# EAGLE design RemoteMotion (EAGLE 9.0.0)
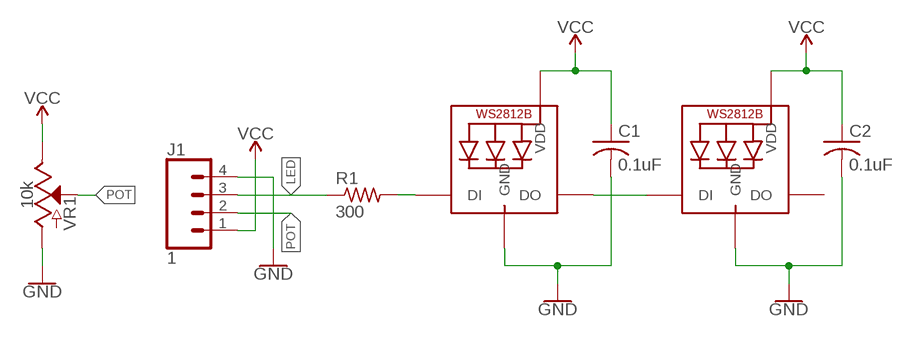
[diagram p0: schematic, sheet 1]

## Parts
C1  0.1uF  C-USC0805  [C0805]
C2  0.1uF  C-USC0805  [C0805]
J1  1  CONN_04JST-PTH  [JST-4-PTH]
LED1  WS2812B5050  [WS2812B]
LED2  WS2812B5050  [WS2812B]
R1  300  R-US_R0805  [R0805]
VR1  10k  POTENTIOMETER_SLIDE-60MM-1/2W-20%  [SLIDER-XLARGE]

## Nets
GND [VCC]: C1.2 C2.2 J1.4 LED1.3-GND(GND) LED2.3-GND(GND) VR1.3(A)
LED: J1.3 R1.1
N$1: LED1.4-DIN(DI) R1.2
N$2: LED1.2-DOUT(DO) LED2.4-DIN(DI)
POT: J1.2 VR1.2A(S)
VCC: C1.1 C2.1 J1.1 LED1.1-VDD(VDD) LED2.1-VDD(VDD) VR1.1(E)
Unconnected: LED2.2-DOUT(DO)

## Library data of the parts
C1 C2 = RemoteMotion:C-US: CAPACITOR, American symbol; SPICEPREFIX: C
J1 = RemoteMotion:CONN_04: Multi connection point. Often used as Generic Header-pin footprint for 0.1 inch spaced/style header connections On any of the 0.1 inch spaced packages, you can populate with these: Break Away Headers - Straight <https://www.sparkfun.com/products/116> (PRT-00116) Break Away Male Headers - Right Angle <https://www.sparkfun.com/products/553> (PRT-00553) Female Headers <https://www.sparkfun.com/products/115> (PRT-00115) Break Away Headers - Machine Pin <https://www.sparkfun.com/products/117> (PRT-00117) Break Away Female Headers - Swiss Machine Pin <https://www.sparkfun.com/products/743> (PRT-00743) For SCREWTERMINALS and SPRING TERMINALS visit here: Screw Terimnals on SparkFun.com <https://www.sparkfun.com/search/results?term=Screw+Terminals> (5mm/3.5mm/2.54mm spacing) This device is also useful as a general connection point to wire up your design to another part of your project. Our various solder wires solder well into these plated through hole pads. Hook-Up Wire - Assortment (Stranded, 22 AWG) <https://www.sparkfun.com/products/11375> (PRT-11375) Hook-Up Wire - Assortment (Solid Core, 22 AWG) <https://www.sparkfun.com/products/11367> (PRT-11367) View the entire wire category on our website here <https://www.sparkfun.com/categories/141> Special notes: Molex polarized connector foot print use with SKU : PRT-08231 with associated crimp pins and housings. 1MM SMD Version SKU: PRT-10208; PROD_ID: WIRE-13531; SF_ID: PRT-09916
LED1 LED2 = RemoteMotion:WS2812B
R1 = RemoteMotion:R-US_: RESISTOR, American symbol; SPICEPREFIX: R
VR1 = RemoteMotion:POTENTIOMETER_SLIDE: Slide Potentiometer Slide-type potentiometers - pots that are adjusted by sliding a wiper up or down. Commonly found en-masse on sound boards. Variants 60MM - Slide Pot - X-Large (10k Linear Taper) <https://www.sparkfun.com/products/9119> (COM-09119) 10k linear slide pot with 60mm travel. Datasheet <http://cdn.sparkfun.com/datasheets/Components/Switches/SC608N-b10k.pdf> 30MM, 30MM-KIT - Slide Pot - Medium (10k Linear Taper) <https://www.sparkfun.com/products/11621> (COM-11621) 10k linear slide pot with 30mm travel. Datasheet <http://cdn.sparkfun.com/datasheets/Components/Switches/C-31-.pdf> (C3031N-1A2-B10K-GP) "KIT" variant, intended for soldering kits, has tStop removed from pads so the component can only be stuffed on one side of the board. 20MM - Slide Pot - Small (10k Linear Taper) <https://www.sparkfun.com/products/11620> (COM-11620) 10k linear slide pot with 20mm travel. Datasheet <http://cdn.sparkfun.com/datasheets/Components/Switches/C-31-.pdf> (C2031N-1A2-B10K-GP); PROD_ID: RES-09484; SF_SKU: COM-09119

## Net classes
0 default: width 0.203 mm
1 VCC: width 0.254 mm

## Board
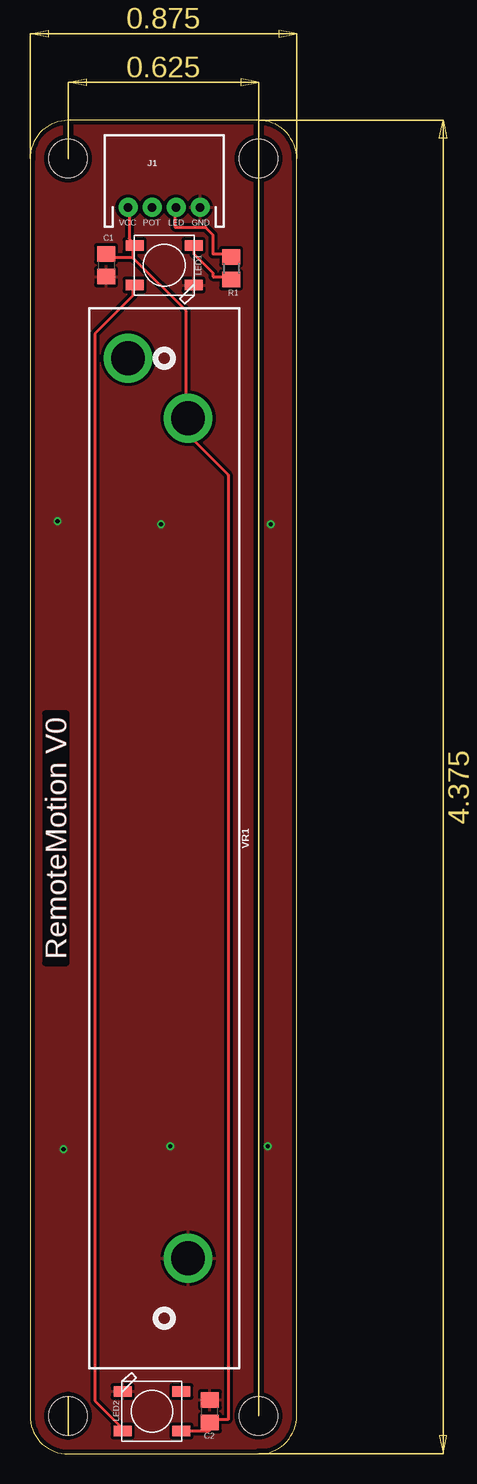
[diagram p1: board, top side]
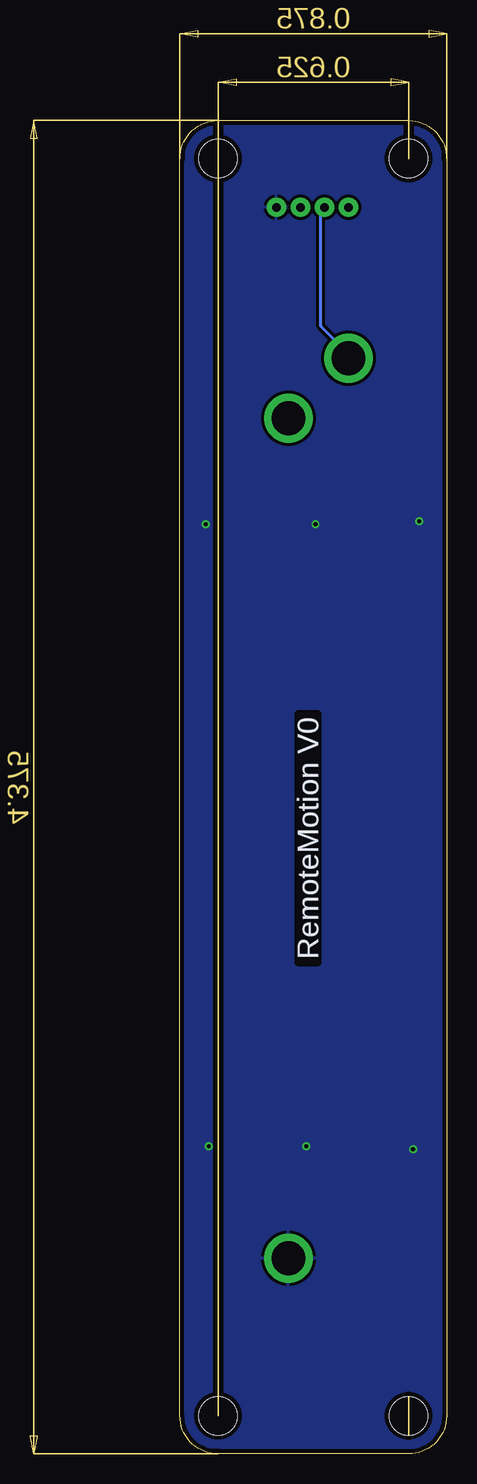
[diagram p2: board, bottom side, seen from below]

Size 22.23 x 111.12 mm. Coordinates in mm from the lower left corner, seen from the top.
Outline: 0,107.95 0,3.17 arc90 3.17,0 19.05,0 arc90 22.23,3.17 22.23,107.95 arc90 19.05,111.12 3.17,111.12 arc90 0,107.95
Copper layers (1*16): Top 0.035559375mm / dielectric 1.6mm / Bottom 0.035559375mm
Design rules "oshpark-2layer-auto-routing *": minimum track width 10mil, minimum drill 10mil, track to track 10mil, track to pad 8mil, pad to pad 8mil, via to via 8mil, smd to smd 6mil, copper to edge 15mil, drill to drill 6mil, minimum pad ring 6mil, minimum via ring 6mil, stop-mask expansion 2.5mil, vias tented up to drill 0mil, thermal gap 10mil
Holes 3.17 mm at 3.17,107.95 3.17,3.17 19.05,3.17 19.05,107.95

### Footprints (pad centres in the part's own frame; a part is rotated, then mirrored left to right if it is on the bottom)
C0805 = smd 1.3 x 1.5: 1 -0.95,0; 2 0.95,0
JST-4-PTH = drill 0.7 pad 1.6: 1 -3,0; 2 -1,0; 3 1,0; 4 3,0
WS2812B = smd 1.5 x 0.9: 1-VDD 2.45,-1.65; 2-DOUT 2.45,1.65; 3-GND -2.45,1.65; 4-DIN -2.45,-1.65
R0805 = smd 1.3 x 1.5: 1 -0.95,0; 2 0.95,0
SLIDER-XLARGE = drill 2.8 pad 4.064: 1 -35,2; 2A -40,-3; 3 35,2

### Placement (x,y rotation side)
C1  6.35,99.06 270 top
C2  14.99,3.56 90 top
J1  11.18,103.89 0 top
LED1  11.18,99.06 180 top
LED2  10.16,3.56 0 top
R1  16.76,98.81 270 top
VR1  11.18,51.31 270 top

### Tracks (layer width: path | path; a pad name or v marks a point on that pad's centre or on a via)
GND  (via drill 0.35)
  other vias: 10.92,77.47 2.29,77.72 20.07,77.47 19.81,25.65 11.68,25.65 2.79,25.4
  pour Top: -0.51,111.51 22.61,111.51 22.61,-0.51 -0.51,-0.51
  pour Bottom: -1.02,112.01 23.11,112.01 23.11,-1.02 -1.02,-1.02
LED
  Top 0.254: R1.1 16.51,100.01 15.24,100.01 15.24,101.6 14.61,102.23 12.06,102.23 12.06,103.82 J1.3
N$1
  Top 0.254: R1.2 16.51,98.11 15.24,98.11 15.24,98.42 13.65,100.01 13.65,100.65 LED1.4-DIN
N$2
  Top 0.254: LED2.4-DIN 7.62,2.22 5.4,4.45 5.4,93.34 8.57,96.52 8.57,97.16 LED1.2-DOUT
POT
  Bottom 0.254: J1.2 10.48,103.82 10.48,93.98 7.94,91.44 VR1.2A
VCC
  Top 0.254: 8.57,99.69 6.35,99.69 C1.1 | 8.57,99.69 8.57,100.65 LED1.1-VDD 8.57,100.97 8.26,101.28 8.26,103.82 J1.1 | LED2.1-VDD 12.7,1.91 14.92,1.91 14.92,2.54 C2.1 15.24,2.86 16.51,2.86 16.51,81.6 13.34,84.77 13.34,86.04 VR1.1 13.02,86.36 13.02,95.25 8.57,99.69

### Text on the board
Top: RemoteMotion V0
Bottom: RemoteMotion V0
tNames: VCC | POT | LED | GND | RemoteMotion V0
bNames: RemoteMotion V0